# Altium schematic sheet LCD_Board.SchDoc
size B
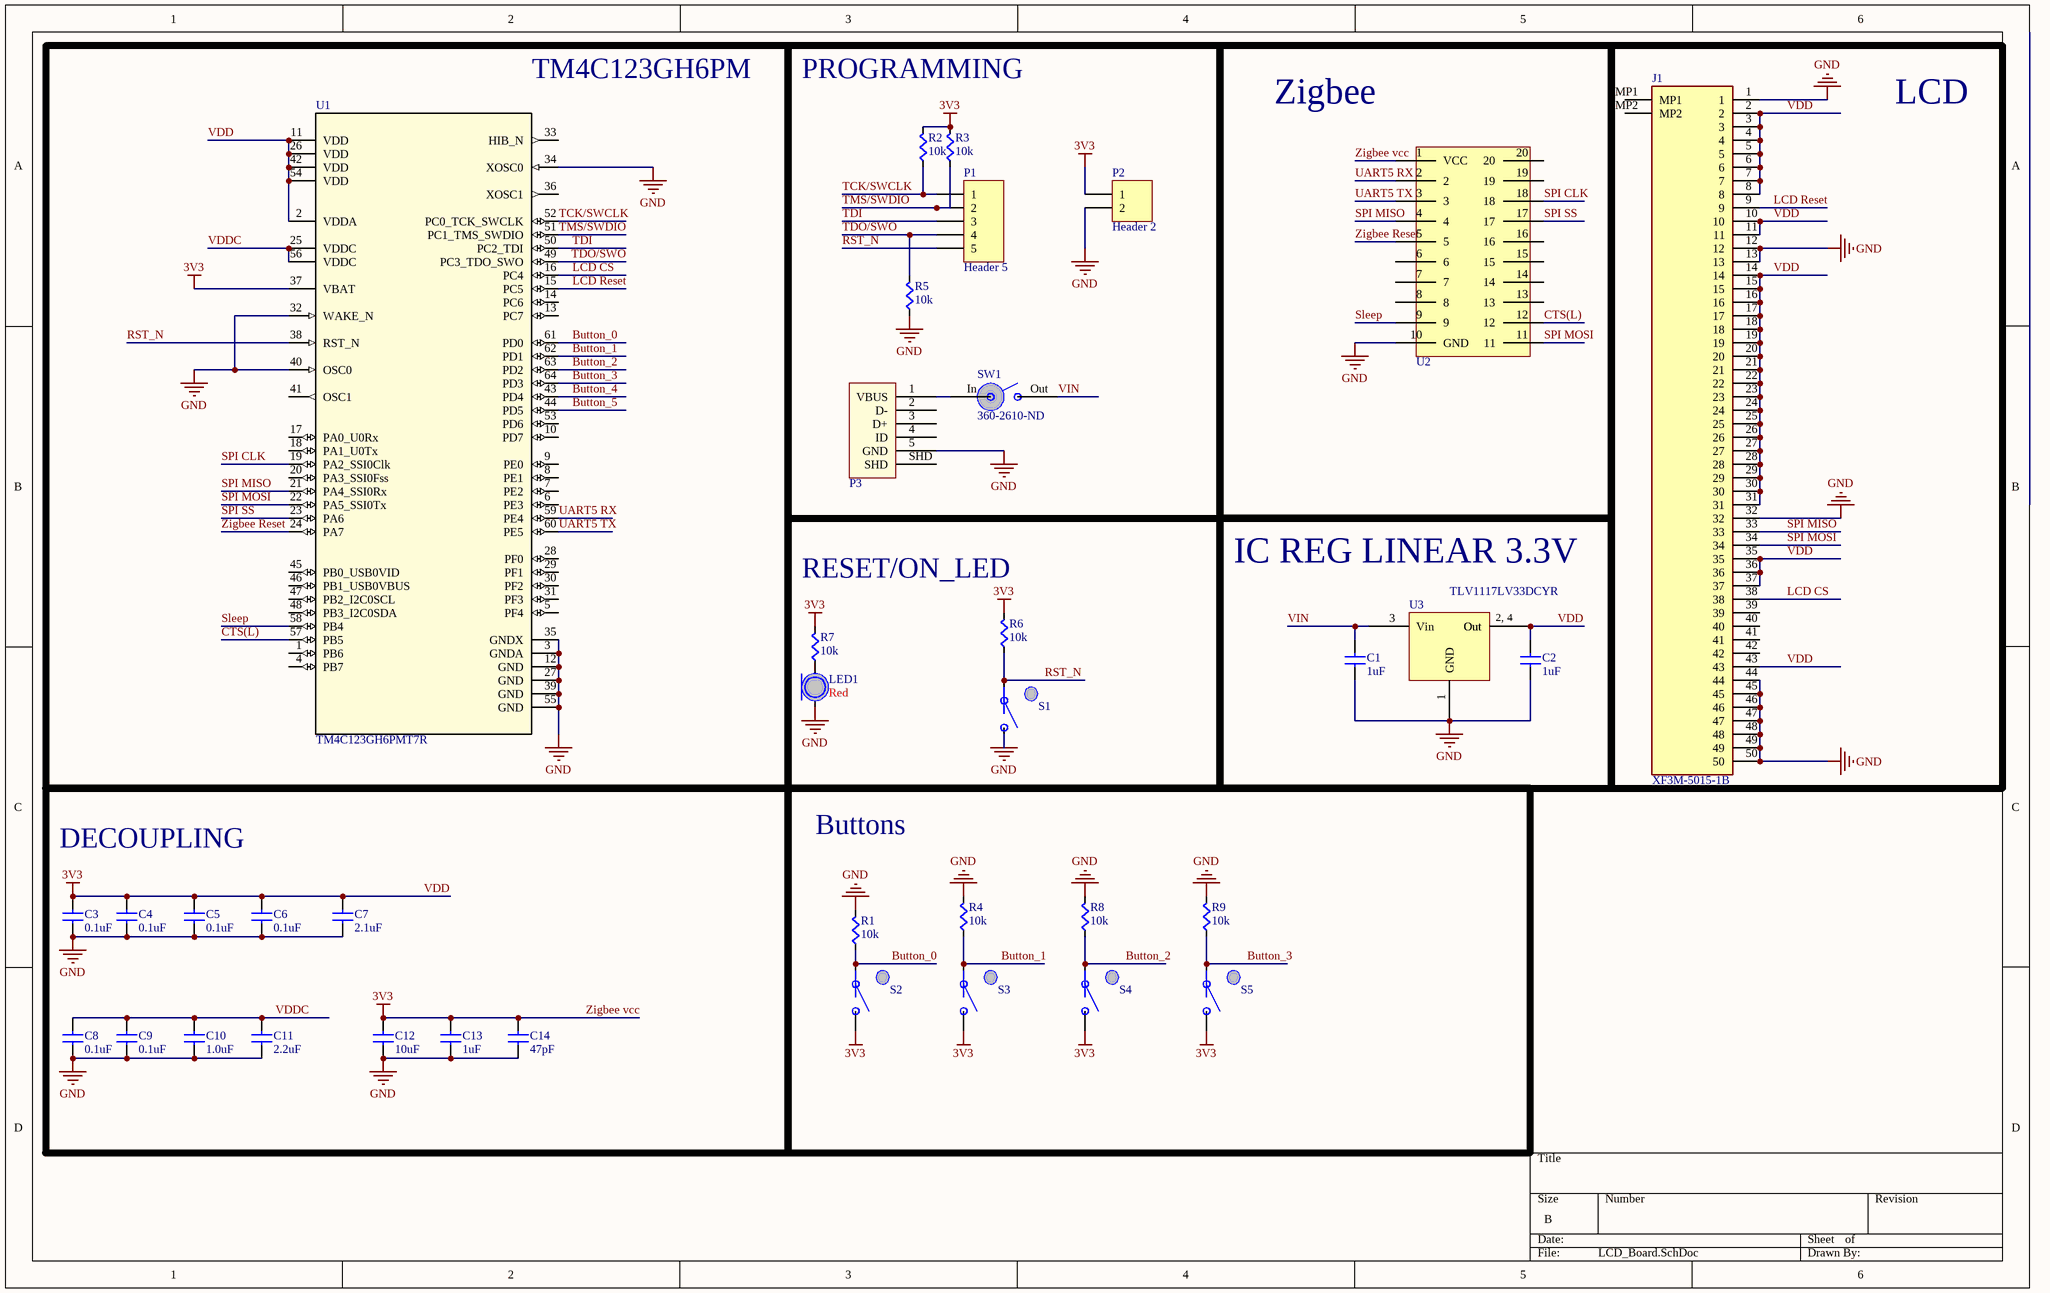
[diagram p0: LCD_Board.SchDoc]

## Parts
C1  value 1uF  [CAPC0603]  (hidden comment: Cap)
C2  value 1uF  [CAPC0603]  (hidden comment: Cap)
C3  value 0.1uF  [CAPC0603]  (hidden comment: Cap)
C4  value 0.1uF  [CAPC0603]  (hidden comment: Cap)
C5  value 0.1uF  [CAPC0603]  (hidden comment: Cap)
C6  value 0.1uF  [CAPC0603]  (hidden comment: Cap)
C7  value 2.1uF  [CAPC0603]  (hidden comment: Cap)
C8  value 0.1uF  [CAPC0603]  (hidden comment: Cap)
C9  value 0.1uF  [CAPC0603]  (hidden comment: Cap)
C10  value 1.0uF  [CAPC0603]  (hidden comment: Cap)
C11  value 2.2uF  [CAPC0603]  (hidden comment: Cap)
C12  value 10uF  [CAPC0603]  (hidden comment: Cap)
C13  value 1uF  [CAPC0603]  (hidden comment: Cap)
C14  value 47pF  [CAPC0603]  (hidden comment: Cap)
J1  XF3M-5015-1B  [XF3M50151B]
LED1  Color: Red  [LED0603]  (hidden comment: LED)
P1  Header 5  [HDR1X5]
P2  Header 2  [HDR1X2]
P3  USB Micro  [10118192-0001LF]  (value not drawn)
R1  value 10k  [RES0603]  (hidden comment: Res)
R2  value 10k  [RES0603]  (hidden comment: Res)
R3  value 10k  [RES0603]  (hidden comment: Res)
R4  value 10k  [RES0603]  (hidden comment: Res)
R5  value 10k  [RES0603]  (hidden comment: Res)
R6  value 10k  [RES0603]  (hidden comment: Res)
R7  value 10k  [RES0603]  (hidden comment: Res)
R8  value 10k  [RES0603]  (hidden comment: Res)
R9  value 10k  [RES0603]  (hidden comment: Res)
S1  Button  [PTS645xxxxSMTR92]  (value not drawn)
S2  Button  [PTS645xxxxSMTR92]  (value not drawn)
S3  Button  [PTS645xxxxSMTR92]  (value not drawn)
S4  Button  [PTS645xxxxSMTR92]  (value not drawn)
S5  Button  [PTS645xxxxSMTR92]  (value not drawn)
SW1  360-2610-ND  [AS11CP]
U1  TM4C123GH6PMT7R  [PM0064A_N]
U2  XBee  [XBee]  (value not drawn)
U3  TLV1117LV33DCYR  [SOT23-4N]

## Blocks framed on the sheet
TM4C123GH6PM: U1
Zigbee: U2
LCD: J1
IC REG LINEAR 3.3V: C1 C2 U3
DECOUPLING: C3-C14
Buttons: R1 R4 R8 R9 S2-S5

## Nets
GND: C1.2(B) C2.2(B) C3.2(B) C4.2(B) C5.2(B) C6.2(B) C7.2(B) C8.2(B) C9.2(B) C10.2(B) C11.2(B) C12.2(B) C13.2(B) C14.2(B) J1.1 J1.12 J1.13 J1.32 J1.44 J1.45 J1.46 J1.47 J1.48 J1.49 J1.50 LED1.C P2.2 P3.5(GND) R1.1(A) R4.1(A) R5.2(B) R8.1(A) R9.1(A) S1.B U1.3(GNDA) U1.12(GND) U1.27(GND) U1.32(WAKE_N) U1.34(XOSC0) U1.35(GNDX) U1.39(GND) U1.40(OSC0) U1.55(GND) U2.10(GND) U3.1(GND)
VDD: C2.1(A) C3.1(A) C4.1(A) C5.1(A) C6.1(A) C7.1(A) C12.1(A) C13.1(A) C14.1(A) J1.2 J1.3 J1.4 J1.5 J1.6 J1.7 J1.8 J1.10 J1.11 J1.14 J1.15 J1.16 J1.17 J1.18 J1.19 J1.20 J1.21 J1.22 J1.23 J1.24 J1.25 J1.26 J1.27 J1.28 J1.29 J1.30 J1.31 J1.35 J1.36 J1.37 J1.43 P2.1 R2.1(A) R3.1(A) R6.1(A) R7.1(A) S2.B S3.B S4.B S5.B U1.2(VDDA) U1.11(VDD) U1.26(VDD) U1.37(VBAT) U1.42(VDD) U1.54(VDD) U2.1(VCC) U3.2(Out) U3.4(Out)  [also labelled 3V3, Zigbee vcc]
Button_0: R1.2(B) S2.A U1.61(PD0)
Button_1: R4.2(B) S3.A U1.62(PD1)
Button_2: R8.2(B) S4.A U1.63(PD2)
Button_3: R9.2(B) S5.A U1.64(PD3)
Button_4: U1.43(PD4)
Button_5: U1.44(PD5)
CTS(L): U1.57(PB5) U2.12
LCD CS: J1.38 U1.16(PC4)
LCD Reset: J1.9 U1.15(PC5)
RST_N: P1.5 R6.2(B) S1.A U1.38(RST_N)
Sleep: U1.58(PB4) U2.9
SPI CLK: U1.19(PA2_SSI0Clk) U2.18
SPI MISO: J1.33 U1.21(PA4_SSI0Rx) U2.4
SPI MOSI: J1.34 U1.22(PA5_SSI0Tx) U2.11
SPI SS: U1.23(PA6) U2.17
TCK/SWCLK: P1.1 R2.2(B) U1.52(PC0_TCK_SWCLK)
TDI: P1.3 U1.50(PC2_TDI)
TDO/SWO: P1.4 R5.1(A) U1.49(PC3_TDO_SWO)
TMS/SWDIO: P1.2 R3.2(B) U1.51(PC1_TMS_SWDIO)
UART5 RX: U1.59(PE4) U2.2
UART5 TX: U1.60(PE5) U2.3
VDDC: C8.1(A) C9.1(A) C10.1(A) C11.1(A) U1.25(VDDC) U1.56(VDDC)
VIN: C1.1(A) SW1.Out U3.3(Vin)
Zigbee Reset: U1.24(PA7) U2.5
NetLED1_A: LED1.A R7.2(B)
NetP3_1: P3.1(VBUS) SW1.In

Not connected (* = marked no-connect by the designer): J1 39 40 41 42 MP1 MP2; P3 2(D-) 3(D+) 4(ID) SHD; U1 1(PB6) 4(PB7) 5(PF4) 6(PE3) 7(PE2) 8(PE1) 9(PE0) 10(PD7) 13(PC7) 14(PC6) 17(PA0_U0Rx) 18(PA1_U0Tx) 20(PA3_SSI0Fss) 28(PF0) 29(PF1) 30(PF2) 31(PF3) 33(HIB_N) 36(XOSC1) 41(OSC1) 45(PB0_USB0VID) 46(PB1_USB0VBUS) 47(PB2_I2C0SCL) 48(PB3_I2C0SDA) 53(PD6); U2 6 7 8 13 14 15 16 19 20

## Notes on the sheet
- PROGRAMMING
- RESET/ON_LED
- (in symbol TLV1117LV33DCYR) 2, 4

## Library data of the parts
C1 C2 = Cap: Manufacturer Part Number: C0603C105K8PACTU; Supplier 1: Digi-Key; Supplier Part Number 1: 399-3118-1-ND
J1 = XF3M-5015-1B: Connector; Manufacturer_Name: Omron Electronics; Datasheet Link: https://componentsearchengine.com/Datasheets/1/XF3M-5015-1B.pdf; Height: 3.13mm; Mouser2 Part Number: 653-XF3M-5015-1B; Mouser2 Price/Stock: https://www.mouser.com/Search/Refine.aspx?Keyword=653-XF3M-5015-1B; Manufacturer_Part_Number: XF3M-5015-1B
P1 = Header 5: Header, 5-Pin; LatestRevisionDate: 17-Jul-2002; LatestRevisionNote: Re-released for DXP Platform.; Publisher: Altium Limited
P2 = Header 2: Header, 2-Pin; LatestRevisionDate: 17-Jul-2002; LatestRevisionNote: Re-released for DXP Platform.; Publisher: Altium Limited
P3 = USB Micro: USB Mini B Metal Shield SMT; Supplier 1: Digi-Key; Supplier Part Number 1: 609-4613-1-ND
S1-S5 = Button: SPST Button; Supplier 1: Digi-Key; Supplier Part Number 1: CKN9087CT-ND
SW1 = SPST Slide Switch: Supplier 1: Digi-Key; Supplier Part Number 1: 360-2610-ND
U1 = TM4C123GH6PMT7R: Imported; PartNumber: TM4C123GH6PMTR; Manufacturer: Texas Instruments; CompType: IC; PIN_COUNT: 64; Application_BuildNumber: *; Alternate_PartNumber: TM4C123GH6PMT; PackageReference: PM0064A; MountType: SMT; RoHS: Y; RefDes: RefDes; TYPE: TYPE; Value: Value
U2 = XBee: XBee radio; Supplier 1: Digi-Key; Supplier Part Number 1: 602-1181-ND
U3 = TLV1117LV33DCYR: IC REG LINEAR 3.3V 1A SOT223-4; Digi-Key Part Number: 296-28778-1-ND
C3-C14 = Cap: Supplier 1: Digi-Key; Supplier Part Number 1: 1276-1000-1-ND
LED1 = LED: Supplier 1: Digi-Key; Supplier Part Number 1: 754-1122-1-ND
R1-R9 = Res: Supplier 1: Digi-Key; Supplier Part Number 1: RMCF0603JT10K0CT-ND